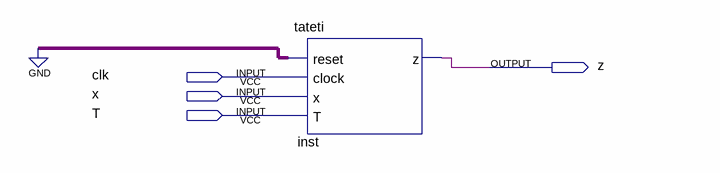
[diagram p0: schematic sheet]
// Quartus schematic antirreboteschem.bdf as structural Verilog: 1 symbols, 4 pins
module antirreboteschem (
  input  clk,
  input  x,
  input  T,
  output z
);

  tateti inst (.reset(1'b0), .clock(clk), .x(x), .T(T), .z(z));
endmodule
